# Altium schematic sheet PAPRika PCB.SchDoc: ProjectTitle
size A3; CompanyName: RespiraWorks; DrawnBy: E. N. Gineer; Organization: Altium; DocumentNumber: 1; Revision: A1; SheetNumber: 1; SheetTotal: 1; PageSetup: Record=PageOptions|CenterHorizontal=True|CenterVertical=True|PrintScale=0.67|XCorrection=1.00|YCorrection=1.00|PrintKind=0|BorderSize=5000000|LeftOffset=0|BottomOffset=0|Orientation=2|PaperLength=1000|PaperWidth=1000|Scale=100|PaperSource=276|PrintQuality=-3|MediaType=1|DitherType=10|PrintScaleMode=1|PaperKind=11"x17" 279.4x431.8mm|PaperIndex=3; ProjectName: FALCON 3S
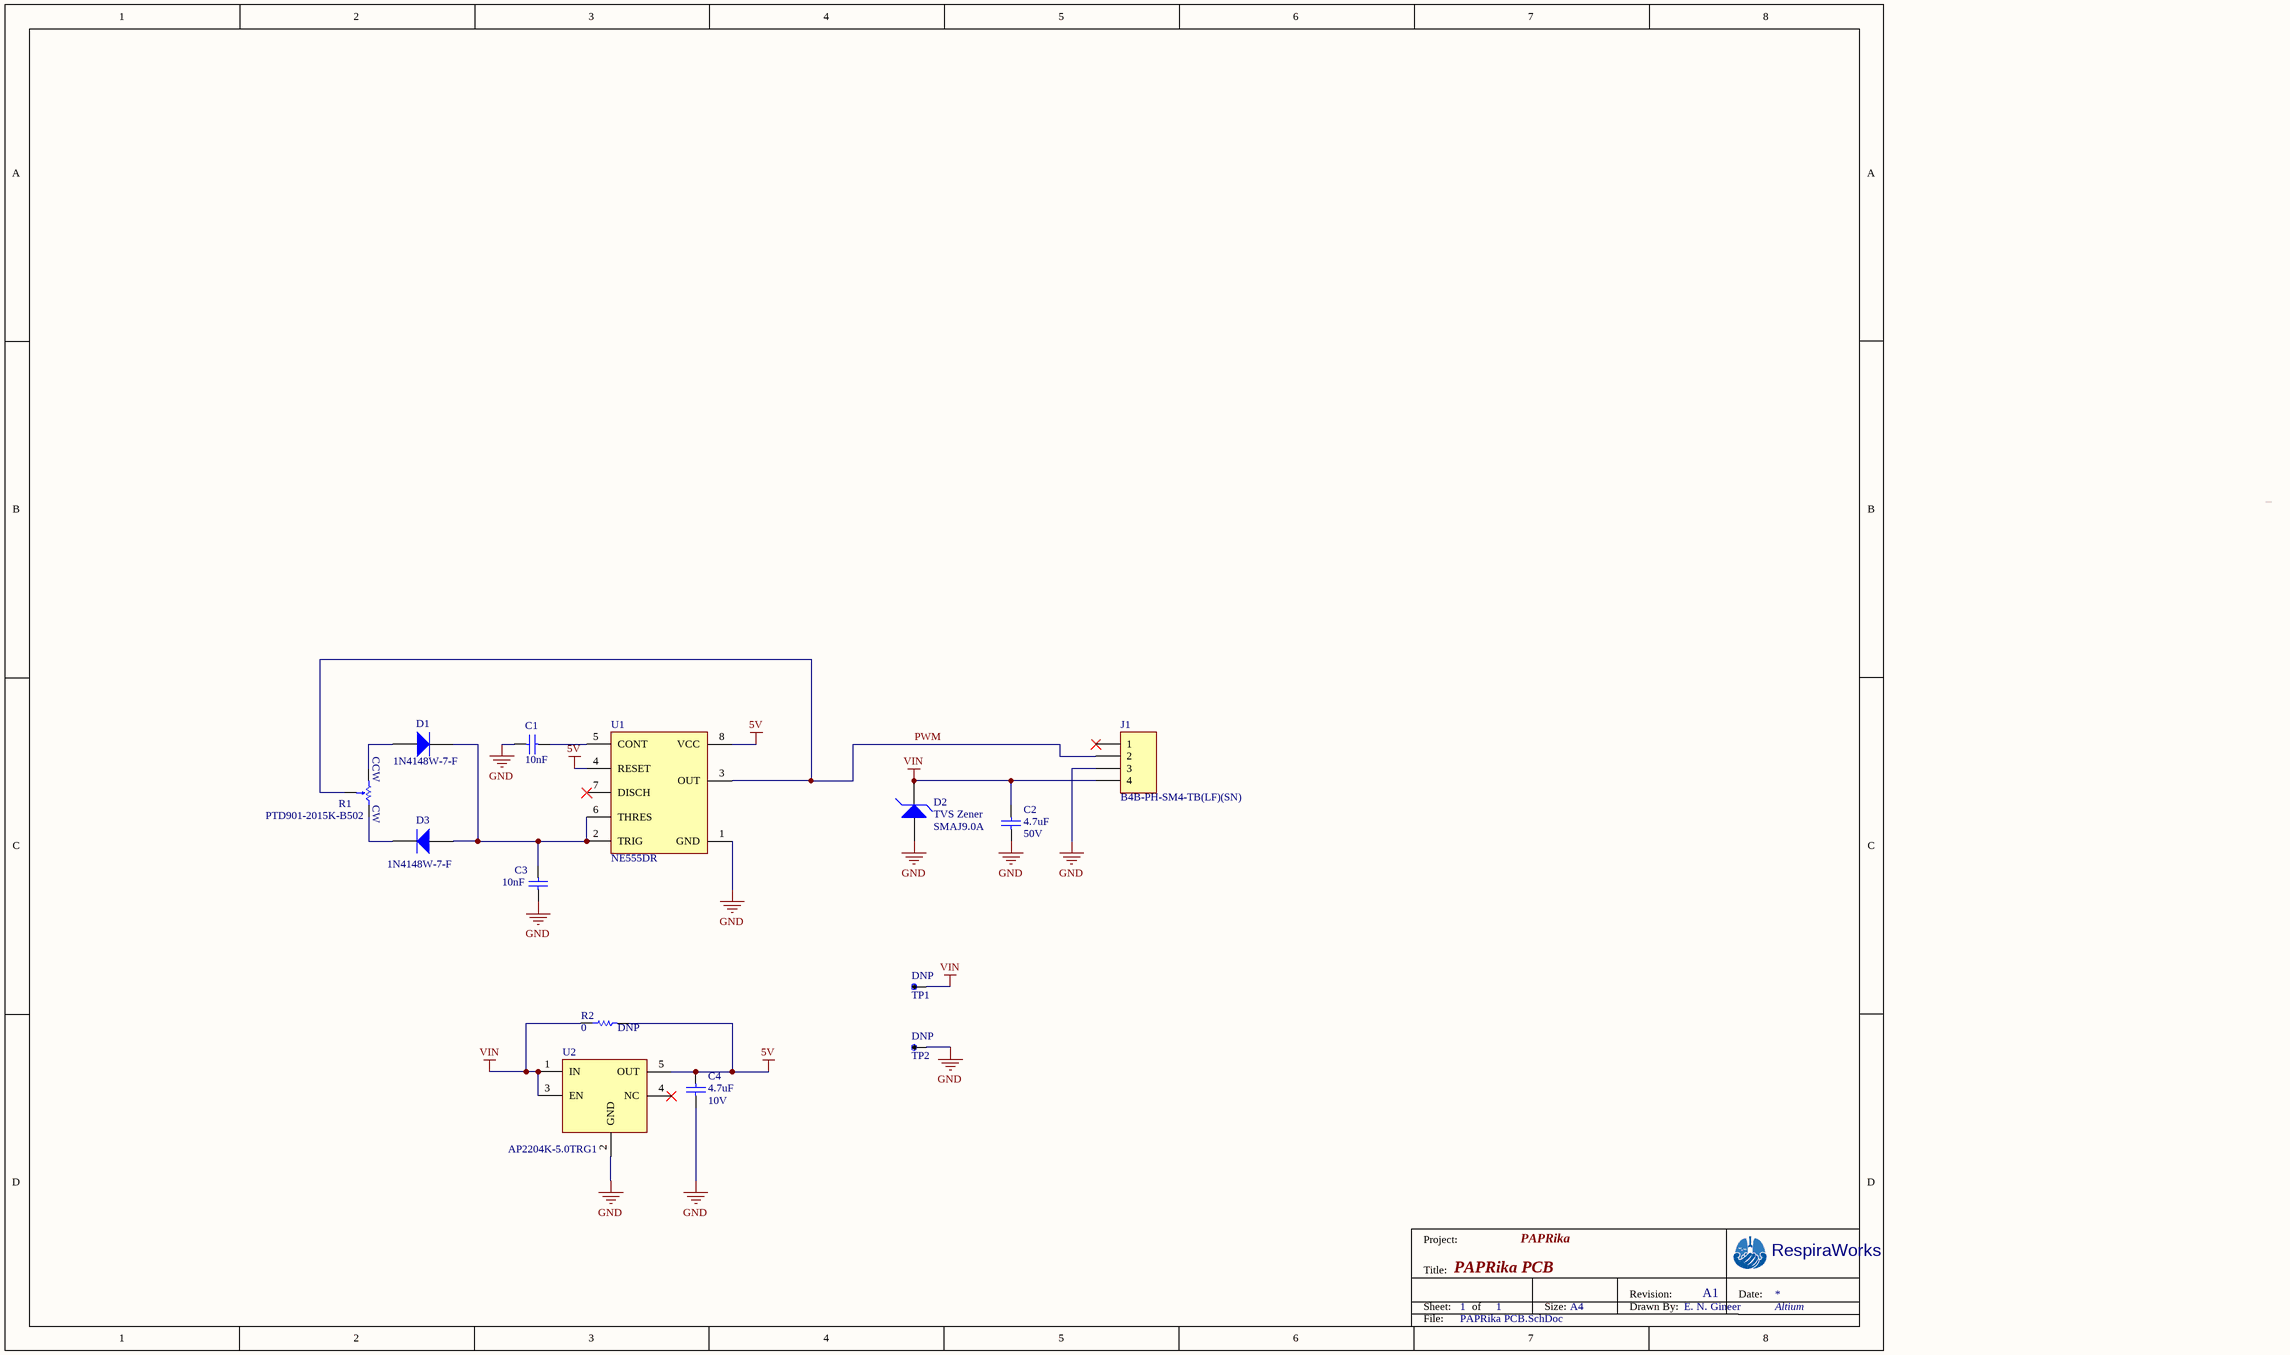
[diagram p0: PAPRika PCB.SchDoc]

## Parts
C1  value 10nF  [CAP0603]  (hidden comment: CAP 0603)
C2  value 4.7uF  Voltage: 50V  [CAP0805]  (hidden comment: CAP 0805)
C3  value 10nF  [CAP0603]  (hidden comment: CAP 0603)
C4  value 4.7uF  Voltage: 10V  [CAP0603]  (hidden comment: CAP 0603)
D1  1N4148W-7-F  [SOD-123]
D2  TVS Zener  [DO-214AC]
D3  1N4148W-7-F  [SOD-123]
J1  B4B-PH-SM4-TB(LF)(SN)  [B4B-PH-SM4-TB]
R1  PTD901-2015K-B502  [PTD901]
R2  value 0  Do Not Populate: DNP  [RES0603]  (hidden comment: RES 0603)
TP1  Do Not Populate: DNP  [TP-5001-BLACK]  (hidden comment: TP-5001-RED)
TP2  Do Not Populate: DNP  [TP-5001-BLACK]  (hidden comment: TP-5001-RED)
U1  NE555DR  [8-D]
U2  AP2204K-5.0TRG1  [5-SOT23]

## Nets
5V: C4.2 R2.2 U1.4(RESET) U1.8(VCC) U2.5(OUT)
GND: C1.2 C2.1 C3.1 C4.1 D2.A J1.3 TP2.1 U1.1(GND) U2.2(GND)
VIN: C2.2 D2.K J1.4 R2.1 TP1.1 U2.1(IN) U2.3(EN)
PWM: J1.2 R1.2 U1.3(OUT)
NetC1_1: C1.1 U1.5(CONT)
NetC3_2: C3.2 D1.K D3.A U1.2(TRIG) U1.6(THRES)
NetD1_A: D1.A R1.1
NetD3_K: D3.K R1.3

Not connected (* = marked no-connect by the designer): J1 1*; U1 7(DISCH)*; U2 4(NC)*

## Notes on the sheet
- Project:
- PAPRika
- Title:
- Sheet:
- PAPRika PCB
- of
- Size:
- A4
- Drawn By:
- Revision:
- Date:
- File:
- (in symbol PTD901-2015K-B502) CCW; CW

## Library data of the parts
C1 C3 = CAP 0603: Manufacturer P/N: CL10B103KB8NNNC; Manufacturer: Samsung; PCB Package: 0603; Voltage: *; Type: *; Do Not Populate: *
C2 = CAP 0805: Manufacturer P/N: CL21A475KBQNNNE; Manufacturer: Samsung; PCB Package: 0805; Type: *; Do Not Populate: *
C4 = CAP 0603: Manufacturer P/N: CL10A475KP8NNNC; Manufacturer: Samsung; PCB Package: 0603; Type: *; Do Not Populate: *
D1 D3 = 1N4148W-7-F: Ultra-Fast Signal Diode, Silicon, 100V, 300mA; Manufacturer: Diodes Inc.; Type: Standard Fast Recovery; Do Not Populate: *; Reverse Voltage: 100V; I(max): 300mA; PCB Package: SOD-123; Manufacturer P/N: 1N4148W-7-F
D2 = SMAJ9.0A: TVS DIODE 9V 15.4V DO214AC; Manufacturer: Littelfuse; Vbr(min): 10.0V; Vr: 9.0V; I(pulse): 26A; Do Not Populate: *; PCB Package: DO-214AC; Manufacturer P/N: SMAJ9.0A
J1 = B4B-PH-SM4-TB(LF)(SN): JST 4-pin Male PCB Straight 2.00mm; Manufacturer: JST; Do Not Populate: *; Manufacturer P/N: B4B-PH-SM4-TB(LF)(SN)
R1 = PTD901-2015K-B502: POT 5K OHM 1/20W CARBON LINEAR; Manufacturer: Bourns; Do Not Populate: *; PCB Package: PTD901; Value: 5K; Manufacturer P/N: PTD901-2015K-B502
R2 = RES 0603: Manufacturer P/N: RC0603FR-070RL; Manufacturer: Yageo; PCB Package: 0603; Tolerance: *
TP1 TP2 = TP-5001-BLACK: Keystone 5001 BLACK TH Mini Testpoint; Manufacturer P/N: 5001; Manufacturer: Keystone; PCB Package: TP-5001-BLACK
U1 = NE555DR: IC OSC SGL TIMER 100KHZ 8-SOIC; Manufacturer: Texas Instruments; PCB Package: 8-SOIC; Do Not Populate: *; Manufacturer P/N: NE555DR
U2 = AP2204K-5.0TRG1: IC REG LINEAR 5V 150MA SOT23-5; Manufacturer: Diodes Inc.; PCB Package: 5-SOT23; Do Not Populate: *; Manufacturer P/N: AP2204K-5.0TRG1